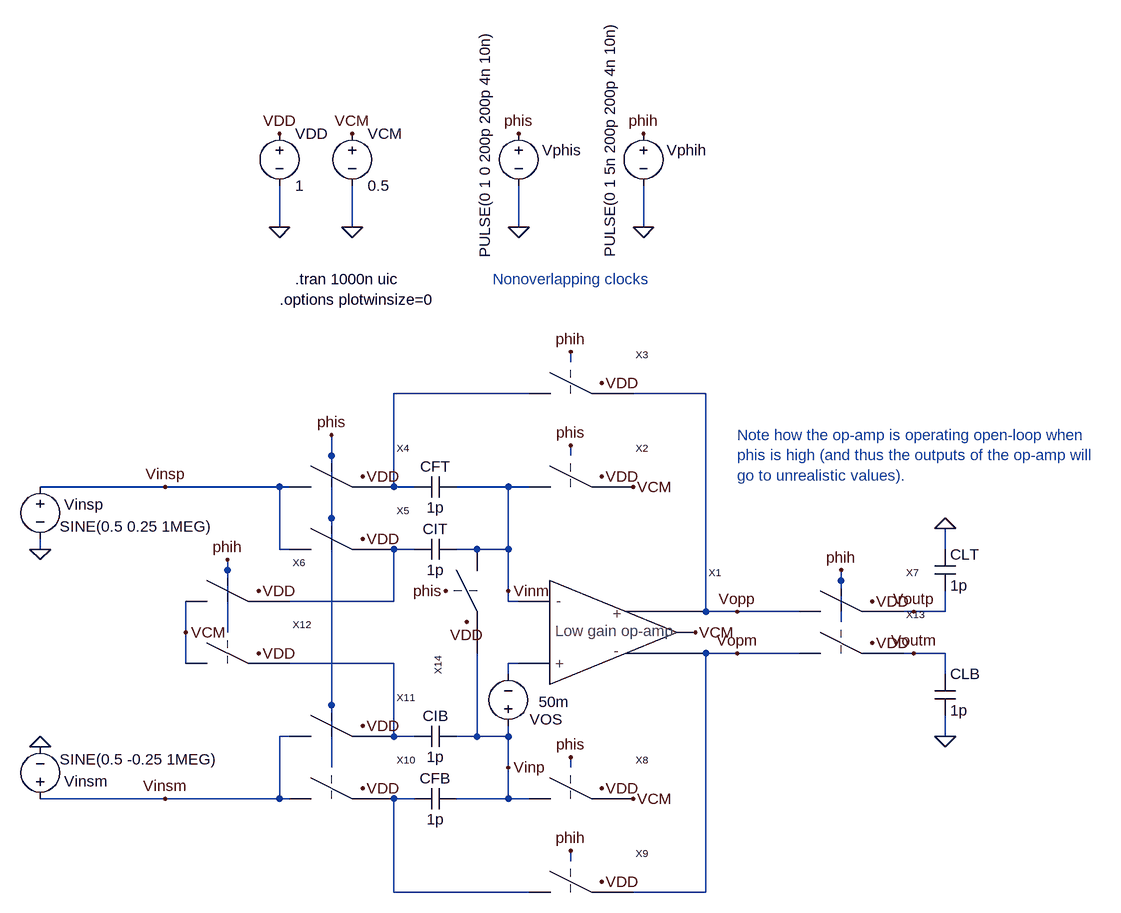
[diagram p0: schematic Fig30_72.asc]
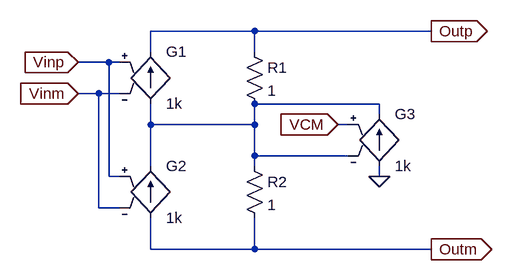
[diagram p1: sub-circuit low_gain_op_amp.asc]
Fig30_72.asc, the LTspice schematic file:
Version 4
SHEET 1 2964 696
WIRE 1312 -2624 1312 -2688
WIRE 1424 -2624 1424 -2688
WIRE 1680 -2624 1680 -2688
WIRE 1872 -2624 1872 -2688
WIRE 1760 -2416 1760 -2432
WIRE 1696 -2368 1488 -2368
WIRE 1968 -2368 1856 -2368
WIRE 1392 -2272 1392 -2304
WIRE 1760 -2272 1760 -2288
WIRE 1136 -2224 944 -2224
WIRE 1312 -2224 1136 -2224
WIRE 1328 -2224 1312 -2224
WIRE 1488 -2224 1488 -2368
WIRE 1520 -2224 1488 -2224
WIRE 1664 -2224 1584 -2224
WIRE 1696 -2224 1664 -2224
WIRE 1392 -2176 1392 -2272
WIRE 944 -2128 944 -2144
WIRE 1312 -2128 1312 -2224
WIRE 1328 -2128 1312 -2128
WIRE 1520 -2128 1488 -2128
WIRE 1616 -2128 1584 -2128
WIRE 1664 -2128 1664 -2224
WIRE 1664 -2128 1616 -2128
WIRE 2336 -2128 2336 -2160
WIRE 1232 -2096 1232 -2112
WIRE 2176 -2080 2176 -2096
WIRE 1664 -2064 1664 -2128
WIRE 1488 -2048 1488 -2128
WIRE 1488 -2048 1328 -2048
WIRE 1664 -2048 1664 -2064
WIRE 1680 -2048 1664 -2048
WIRE 1968 -2032 1968 -2368
WIRE 2016 -2032 1968 -2032
WIRE 2112 -2032 2016 -2032
WIRE 2288 -2032 2272 -2032
WIRE 2336 -2032 2336 -2064
WIRE 2336 -2032 2288 -2032
WIRE 2176 -2016 2176 -2080
WIRE 1168 -2000 1168 -2048
WIRE 1232 -2000 1232 -2096
WIRE 2016 -1968 1968 -1968
WIRE 2112 -1968 2016 -1968
WIRE 2288 -1968 2272 -1968
WIRE 2336 -1968 2288 -1968
WIRE 1168 -1952 1168 -2000
WIRE 1488 -1952 1328 -1952
WIRE 1680 -1952 1664 -1952
WIRE 1664 -1936 1664 -1952
WIRE 2336 -1936 2336 -1968
WIRE 1392 -1888 1392 -2176
WIRE 1328 -1840 1312 -1840
WIRE 1488 -1840 1488 -1952
WIRE 1520 -1840 1488 -1840
WIRE 1616 -1840 1616 -1968
WIRE 1616 -1840 1584 -1840
WIRE 1664 -1840 1664 -1856
WIRE 1664 -1840 1616 -1840
WIRE 2336 -1840 2336 -1872
WIRE 1392 -1792 1392 -1888
WIRE 1664 -1792 1664 -1840
WIRE 1760 -1792 1760 -1808
WIRE 1136 -1744 944 -1744
WIRE 1312 -1744 1312 -1840
WIRE 1312 -1744 1136 -1744
WIRE 1328 -1744 1312 -1744
WIRE 1520 -1744 1488 -1744
WIRE 1664 -1744 1664 -1792
WIRE 1664 -1744 1584 -1744
WIRE 1696 -1744 1664 -1744
WIRE 1760 -1648 1760 -1664
WIRE 1488 -1600 1488 -1744
WIRE 1696 -1600 1488 -1600
WIRE 1968 -1600 1968 -1968
WIRE 1968 -1600 1856 -1600
FLAG 1312 -2624 0
FLAG 1312 -2768 VDD
FLAG 1680 -2624 0
FLAG 1680 -2768 phis
FLAG 1424 -2624 0
FLAG 1424 -2768 VCM
FLAG 1872 -2624 0
FLAG 1872 -2768 phih
FLAG 1808 -2384 VDD
FLAG 1808 -2240 VDD
FLAG 1760 -2432 phih
FLAG 1760 -2288 phis
FLAG 1440 -2144 VDD
FLAG 1440 -2240 VDD
FLAG 1392 -2304 phis
FLAG 1232 -2112 phih
FLAG 1136 -2224 Vinsp
FLAG 1952 -2000 VCM
FLAG 2016 -2032 Vopp
FLAG 1280 -2064 VDD
FLAG 2224 -2048 VDD
FLAG 2176 -2096 phih
FLAG 2336 -2160 0
FLAG 944 -2128 0
FLAG 1808 -1616 VDD
FLAG 1808 -1760 VDD
FLAG 1760 -1664 phih
FLAG 1760 -1808 phis
FLAG 1440 -1856 VDD
FLAG 1440 -1760 VDD
FLAG 1136 -1744 Vinsm
FLAG 2016 -1968 Vopm
FLAG 1280 -1968 VDD
FLAG 2224 -1984 VDD
FLAG 2336 -1840 0
FLAG 944 -1824 0
FLAG 1168 -2000 VCM
FLAG 2288 -1968 Voutm
FLAG 2288 -2032 Voutp
FLAG 1664 -2064 Vinm
FLAG 1664 -1792 Vinp
FLAG 1856 -2224 VCM
FLAG 1856 -1744 VCM
FLAG 1600 -2016 VDD
FLAG 1568 -2064 phis
SYMBOL voltage 1312 -2784 R0
WINDOW 123 0 0 Left 0
WINDOW 39 0 0 Left 0
SYMATTR InstName VDD
SYMATTR Value 1
SYMBOL voltage 1680 -2784 R0
WINDOW 0 36 42 Left 0
WINDOW 3 -52 207 VLeft 0
WINDOW 123 0 0 Left 0
WINDOW 39 0 0 Left 0
SYMATTR InstName Vphis
SYMATTR Value PULSE(0 1 0 200p 200p 4n 10n)
SYMBOL voltage 1424 -2784 R0
WINDOW 123 0 0 Left 0
WINDOW 39 0 0 Left 0
SYMATTR InstName VCM
SYMATTR Value 0.5
SYMBOL voltage 1872 -2784 R0
WINDOW 0 36 42 Left 0
WINDOW 3 -52 207 VLeft 0
WINDOW 123 0 0 Left 0
WINDOW 39 0 0 Left 0
SYMATTR InstName Vphih
SYMATTR Value PULSE(0 1 5n 200p 200p 4n 10n)
SYMBOL switch_1 1696 -2208 R0
SYMATTR InstName X2
SYMBOL switch_1 1696 -2352 R0
SYMATTR InstName X3
SYMBOL cap 1520 -2112 R270
WINDOW 0 32 32 VTop 0
WINDOW 3 0 32 VBottom 0
SYMATTR InstName CIT
SYMATTR Value 1p
SYMBOL cap 1520 -2208 R270
WINDOW 0 32 32 VTop 0
WINDOW 3 0 32 VBottom 0
SYMATTR InstName CFT
SYMATTR Value 1p
SYMBOL switch_1 1328 -2208 R0
SYMATTR InstName X4
SYMBOL switch_1 1328 -2112 R0
SYMATTR InstName X5
SYMBOL switch_1 1168 -2032 R0
SYMATTR InstName X6
SYMBOL switch_1 2112 -2016 R0
SYMATTR InstName X7
SYMBOL cap 2320 -2128 R0
SYMATTR InstName CLT
SYMATTR Value 1p
SYMBOL voltage 944 -2240 R0
WINDOW 0 37 43 Left 0
WINDOW 3 30 77 Left 0
WINDOW 123 0 0 Left 0
WINDOW 39 0 0 Left 0
SYMATTR InstName Vinsp
SYMATTR Value SINE(0.5 0.25 1MEG)
SYMBOL switch_1 1696 -1728 R0
SYMATTR InstName X8
SYMBOL switch_1 1696 -1584 R0
SYMATTR InstName X9
SYMBOL cap 1520 -1856 M90
WINDOW 0 0 32 VBottom 0
WINDOW 3 32 32 VTop 0
SYMATTR InstName CIB
SYMATTR Value 1p
SYMBOL cap 1520 -1760 M90
WINDOW 0 0 32 VBottom 0
WINDOW 3 32 32 VTop 0
SYMATTR InstName CFB
SYMATTR Value 1p
SYMBOL switch_1 1328 -1728 R0
SYMATTR InstName X10
SYMBOL switch_1 1328 -1824 R0
SYMATTR InstName X11
SYMBOL switch_1 1168 -1936 R0
SYMATTR InstName X12
SYMBOL switch_1 2112 -1952 R0
SYMATTR InstName X13
SYMBOL cap 2320 -1872 M180
WINDOW 0 24 64 Left 0
WINDOW 3 24 8 Left 0
SYMATTR InstName CLB
SYMATTR Value 1p
SYMBOL voltage 944 -1728 M180
WINDOW 0 37 43 Left 0
WINDOW 3 30 77 Left 0
WINDOW 123 0 0 Left 0
WINDOW 39 0 0 Left 0
SYMATTR InstName Vinsm
SYMATTR Value SINE(0.5 -0.25 1MEG)
SYMBOL voltage 1664 -1840 R180
WINDOW 0 -83 26 Left 0
WINDOW 3 -94 53 Left 0
WINDOW 123 0 0 Left 0
WINDOW 39 0 0 Left 0
SYMATTR InstName VOS
SYMATTR Value 50m
SYMBOL switch_1 1632 -2128 M90
SYMATTR InstName X14
SYMBOL Low_gain_op_amp 1728 -2000 R0
SYMATTR InstName X1
TEXT 1336 -2544 Left 0 !.tran 1000n uic
TEXT 1640 -2544 Left 0 ;Nonoverlapping clocks
TEXT 2016 -2304 Left 0 ;Note how the op-amp is operating open-loop when \nphis is high (and thus the outputs of the op-amp will \ngo to unrealistic values).
TEXT 1312 -2512 Left 0 !.options plotwinsize=0

low_gain_op_amp.asc, the sub-circuit schematic file:
Version 4
SHEET 1 6300 692
WIRE 1632 240 1472 240
WIRE 1904 240 1632 240
WIRE 1472 272 1472 240
WIRE 1632 272 1632 240
WIRE 1408 288 1360 288
WIRE 1424 288 1408 288
WIRE 1392 336 1360 336
WIRE 1424 336 1392 336
WIRE 1824 352 1632 352
WIRE 1824 368 1824 352
WIRE 1472 384 1472 352
WIRE 1632 384 1632 352
WIRE 1632 384 1472 384
WIRE 1776 384 1760 384
WIRE 1632 432 1632 384
WIRE 1776 432 1632 432
WIRE 1472 448 1472 384
WIRE 1632 448 1632 432
WIRE 1408 464 1408 288
WIRE 1424 464 1408 464
WIRE 1824 464 1824 448
WIRE 1392 512 1392 336
WIRE 1424 512 1392 512
WIRE 1472 576 1472 528
WIRE 1632 576 1632 528
WIRE 1632 576 1472 576
WIRE 1904 576 1632 576
FLAG 1904 240 Outp
IOPIN 1904 240 Out
FLAG 1360 288 Vinp
IOPIN 1360 288 In
FLAG 1360 336 Vinm
IOPIN 1360 336 In
FLAG 1904 576 Outm
IOPIN 1904 576 Out
FLAG 1760 384 VCM
IOPIN 1760 384 In
FLAG 1824 464 0
SYMBOL res 1616 256 R0
SYMATTR InstName R1
SYMATTR Value 1
SYMBOL res 1616 432 R0
SYMATTR InstName R2
SYMATTR Value 1
SYMBOL g 1472 256 R0
SYMATTR InstName G1
SYMATTR Value 1k
SYMBOL g 1472 432 R0
SYMATTR InstName G2
SYMATTR Value 1k
SYMBOL g 1824 352 R0
SYMATTR InstName G3
SYMATTR Value 1k

The netlist it stands for:
* Fig30_72.asc
VDD VDD 0 1
Vphis phis 0 PULSE(0 1 0 200p 200p 4n 10n)
VCM VCM 0 0.5
Vphih phih 0 PULSE(0 1 5n 200p 200p 4n 10n)
XX2 Vinm VCM phis VDD switch_1  ; pins P1 P2 clk VDD
XX3 N001 Vopp phih VDD switch_1  ; pins P1 P2 clk VDD
CIT N002 Vinm 1p
CFT N001 Vinm 1p
XX4 Vinsp N001 phis VDD switch_1  ; pins P1 P2 clk VDD
XX5 Vinsp N002 phis VDD switch_1  ; pins P1 P2 clk VDD
XX6 VCM N002 phih VDD switch_1  ; pins P1 P2 clk VDD
XX7 Vopp Voutp phih VDD switch_1  ; pins P1 P2 clk VDD
CLT 0 Voutp 1p
Vinsp Vinsp 0 SINE(0.5 0.25 1MEG)
XX8 Vinp VCM phis VDD switch_1  ; pins P1 P2 clk VDD
XX9 N005 Vopm phih VDD switch_1  ; pins P1 P2 clk VDD
CIB N003 Vinp 1p
CFB N005 Vinp 1p
XX10 Vinsm N005 phis VDD switch_1  ; pins P1 P2 clk VDD
XX11 Vinsm N003 phis VDD switch_1  ; pins P1 P2 clk VDD
XX12 VCM N003 phih VDD switch_1  ; pins P1 P2 clk VDD
XX13 Vopm Voutm phih VDD switch_1  ; pins P1 P2 clk VDD
CLB 0 Voutm 1p
Vinsm Vinsm 0 SINE(0.5 -0.25 1MEG)
VOS Vinp N004 50m
XX14 Vinm Vinp phis VDD switch_1  ; pins P1 P2 clk VDD
XX1 Vinm N004 Vopp VCM Vopm low_gain_op_amp

* block symbol definitions
.subckt low_gain_op_amp Vinm Vinp Outp VCM Outm
R1 Outp N001 1
R2 N001 Outm 1
G1 N001 Outp Vinp Vinm 1k
G2 Outm N001 Vinp Vinm 1k
G3 0 N001 VCM N001 1k
.ends low_gain_op_amp

.tran 1000n uic
* Nonoverlapping clocks
* Note how the op-amp is operating open-loop when
* phis is high (and thus the outputs of the op-amp will
* go to unrealistic values).
.options plotwinsize=0
.backanno
.end